# Altium project COMECA - MCU Board.PrjPcb
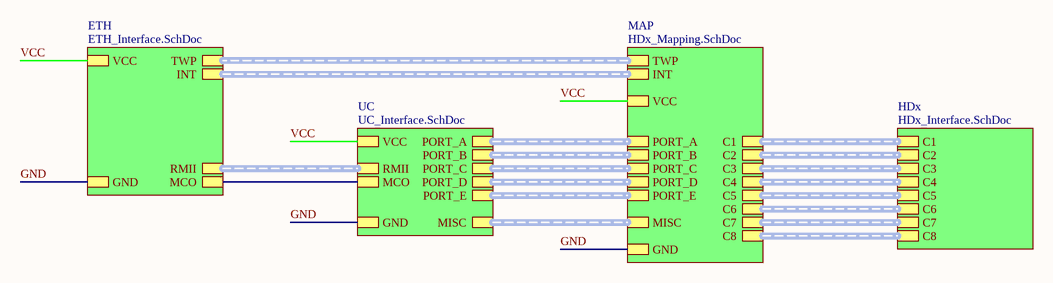
[diagram p0: MCU_Board_top.SchDoc]
5 sheets, 38 parts. Net scope: strictly hierarchical (ports join the sheet entries above them; power ports are local).
Board file: MCU_Board.PcbDoc
Sheets:
  MCU_Board_top.SchDoc
    HDx = HDx_Interface.SchDoc
    ETH = ETH_Interface.SchDoc
    UC = UC_Interface.SchDoc
    MAP = HDx_Mapping.SchDoc

## Sheet MCU_Board_top.SchDoc
size A4; SheetNumber: 1; SheetTotal: 5

### Sub-sheets
ETH = ETH_Interface.SchDoc: GND, VCC, INT (harness INTERFACE), RMII (harness RMII), MCO, TWP (harness TWP_INTERFACE)
HDx = HDx_Interface.SchDoc: C1 (harness C1), C2 (harness C2), C3 (harness C3), C4 (harness C4), C6 (harness C6), C5 (harness C5), C8 (harness C8), C7 (harness C7)
MAP = HDx_Mapping.SchDoc: C1 (harness C1), PORT_A (harness PORT_A), C2 (harness C2), C3 (harness C3), C4 (harness C4), C5 (harness C5), C6 (harness C6), C7 (harness C7), C8 (harness C8), PORT_B (harness PORT_B), PORT_C (harness PORT_C), PORT_D (harness PORT_D), PORT_E (harness PORT_E), MISC (harness MISC), GND, VCC, TWP (harness TWP_INTERFACE), INT (harness INTERFACE)
UC = UC_Interface.SchDoc: GND, VCC, RMII (harness RMII), MCO, PORT_A (harness PORT_A), PORT_B (harness PORT_B), PORT_C (harness PORT_C), PORT_D (harness PORT_D), PORT_E (harness PORT_E), MISC (harness MISC)

### Nets
GND: sheet ETH/GND, sheet UC/GND, sheet MAP/GND
MCO: sheet ETH/MCO, sheet UC/MCO
VCC: sheet ETH/VCC, sheet UC/VCC, sheet MAP/VCC

### Buses and harness runs
harness sheet ETH/INT = sheet MAP/INT
harness sheet ETH/RMII = sheet UC/RMII
harness sheet ETH/TWP = sheet MAP/TWP
harness sheet HDx/C1 = sheet MAP/C1
harness sheet HDx/C2 = sheet MAP/C2
harness sheet HDx/C3 = sheet MAP/C3
harness sheet HDx/C4 = sheet MAP/C4
harness sheet HDx/C5 = sheet MAP/C5
harness sheet HDx/C6 = sheet MAP/C6
harness sheet HDx/C7 = sheet MAP/C7
harness sheet HDx/C8 = sheet MAP/C8
harness sheet MAP/MISC = sheet UC/MISC
harness sheet MAP/PORT_A = sheet UC/PORT_A
harness sheet MAP/PORT_B = sheet UC/PORT_B
harness sheet MAP/PORT_C = sheet UC/PORT_C
harness sheet MAP/PORT_D = sheet UC/PORT_D
harness sheet MAP/PORT_E = sheet UC/PORT_E

## Sheet HDx_Interface.SchDoc
size A4; SheetNumber: 4; SheetTotal: 5
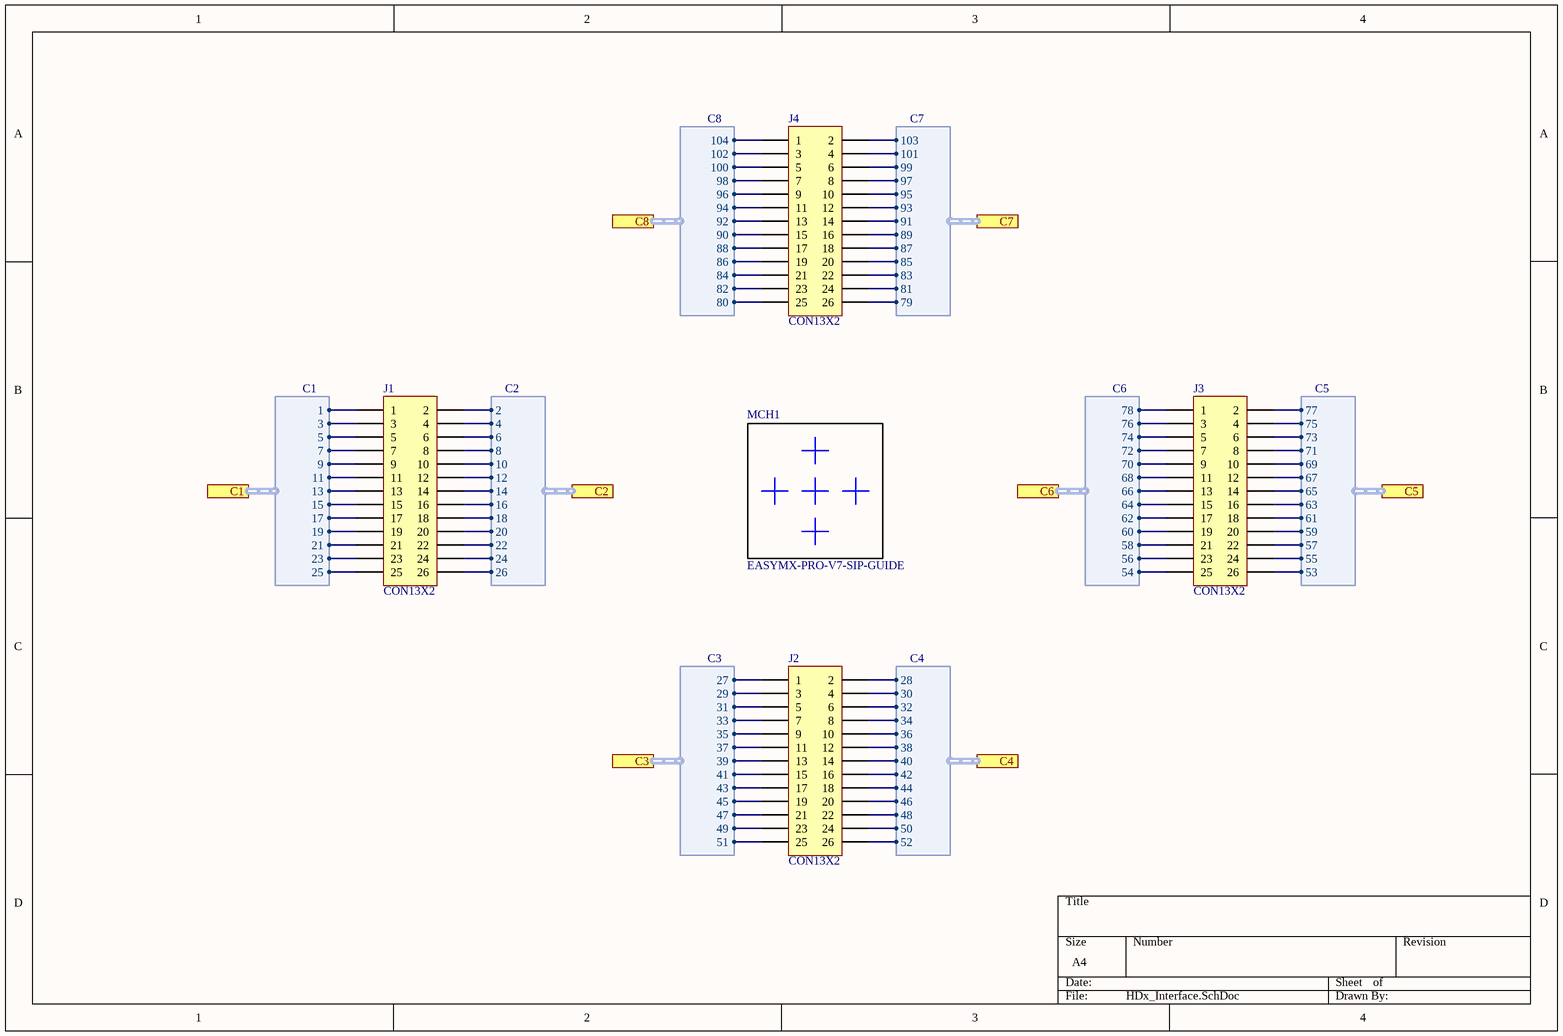
[diagram p1: HDx_Interface.SchDoc]

### Parts
J1  CON13X2  [SIP13X2]
J2  CON13X2  [SIP13X2]
J3  CON13X2  [SIP13X2]
J4  CON13X2  [SIP13X2]
MCH1  EASYMX-PRO-V7-SIP-GUIDE  [EASYMX-PRO-V7-MCH-GUIDE]  (no BOM)

### Ports
C1 (harness C1, see MCU_Board_top[3B], HDx_Mapping[6A]), C2 (harness C2, see MCU_Board_top[3B], HDx_Mapping[7A]), C3 (harness C3, see MCU_Board_top[3B], HDx_Mapping[6B]), C4 (harness C4, see MCU_Board_top[3B], HDx_Mapping[7B]), C5 (harness C5, see MCU_Board_top[3B], HDx_Mapping[6C]), C6 (harness C6, see MCU_Board_top[3B], HDx_Mapping[7C]), C7 (harness C7, see MCU_Board_top[3C], HDx_Mapping[6C]), C8 (harness C8, see MCU_Board_top[3C], HDx_Mapping[7C])

### Harnesses
C1: 1, 3, 5, 7, 9, 11, 13, 15, 17, 19, 21, 23, 25
C2: 2, 4, 6, 8, 10, 12, 14, 16, 18, 20, 22, 24, 26
C3: 27, 29, 31, 33, 35, 37, 39, 41, 43, 45, 47, 49, 51
C4: 28, 30, 32, 34, 36, 38, 40, 42, 44, 46, 48, 50, 52
C6: 54, 56, 58, 60, 62, 64, 66, 68, 70, 72, 74, 76, 78
C5: 53, 55, 57, 59, 61, 63, 65, 67, 69, 71, 73, 75, 77
C8: 80, 82, 84, 86, 88, 90, 92, 94, 96, 98, 100, 102, 104
C7: 79, 81, 83, 85, 87, 89, 91, 93, 95, 97, 99, 101, 103

### Nets
BT0: J3.22 ; port C5.57
GND: J1.26 J2.2 J2.26 J3.1 J3.25 J4.1 J4.25 ; port C2.26, port C4.28, port C4.52, port C6.54, port C6.78, port C8.80, port C8.104
LED1: J1.5 ; port C1.5
LED2: J1.6 ; port C2.6
nRST: J3.10 ; port C5.69
PA0: J3.4 ; port C5.75
PA3: J4.24 ; port C7.81
PA4: J4.21 ; port C8.84
PA5: J4.22 ; port C7.83
PA6: J4.19 ; port C8.86
PA9: J2.4 ; port C4.30
PA10: J2.3 ; port C3.29
PA11: J2.8 ; port C4.34
PA12: J2.7 ; port C3.33
PA13: J2.10 ; port C4.36
PA14: J2.9 ; port C3.35
PA15: J2.12 ; port C4.38
PB0: J4.15 ; port C8.90
PB1: J4.16 ; port C7.89
PB2: J4.13 ; port C8.92
PB3: J2.23 ; port C3.49
PB4: J2.24 ; port C4.50
PB5: J3.23 ; port C6.56
PB6: J3.24 ; port C5.55
PB7: J3.21 ; port C6.58
PB8: J3.20 ; port C5.59
PB9: J3.19 ; port C6.60
PC0: J3.9 ; port C6.70
PC2: J3.7 ; port C6.72
PC3: J3.6 ; port C5.73
PC6: J1.20 ; port C2.20
PC7: J1.19 ; port C1.19
PC8: J1.22 ; port C2.22
PC9: J1.21 ; port C1.21
PC13: J3.11 ; port C6.68
PD0: J2.16 ; port C4.42
PD1: J2.15 ; port C3.41
PD2: J2.18 ; port C4.44
PD3: J2.17 ; port C3.43
PD4: J2.20 ; port C4.46
PD5: J2.19 ; port C3.45
PD6: J2.22 ; port C4.48
PD7: J2.21 ; port C3.47
PD8: J1.12 ; port C2.12
PD9: J1.11 ; port C1.11
PD10: J1.14 ; port C2.14
PD11: J1.13 ; port C1.13
PD12: J1.16 ; port C2.16
PD13: J1.15 ; port C1.15
PD14: J1.18 ; port C2.18
PD15: J1.17 ; port C1.17
PE0: J3.18 ; port C5.61
PE1: J3.17 ; port C6.62
PE2: J3.16 ; port C5.63
PE3: J3.15 ; port C6.64
PE4: J3.14 ; port C5.65
PE5: J3.13 ; port C6.66
PE6: J3.12 ; port C5.67
PE7: J4.14 ; port C7.91
PE8: J4.11 ; port C8.94
PE9: J4.12 ; port C7.93
PE10: J4.9 ; port C8.96
PE11: J4.10 ; port C7.95
PE12: J4.7 ; port C8.98
PE13: J4.8 ; port C7.97
PE14: J4.5 ; port C8.100
PE15: J4.6 ; port C7.99
RX_N: J1.3 ; port C1.3
RX_P: J1.4 ; port C2.4
SPI_MISO: J1.10 ; port C2.10
SPI_MOSI: J1.9 ; port C1.9
SPI_SCK: J1.7 ; port C1.7
TX_N: J1.1 ; port C1.1
TX_P: J1.2 ; port C2.2
VBAT: J1.23 ; port C1.23
VCC: J1.25 J2.1 J2.25 J3.2 J3.26 J4.2 J4.26 ; port C1.25, port C3.27, port C3.51, port C5.53, port C5.77, port C7.79, port C7.103
VREF: J3.5 ; port C6.74
NetJ1_8: J1.8 ; port C2.8
NetJ1_24: J1.24 ; port C2.24
NetJ2_5: J2.5 ; port C3.31
NetJ2_6: J2.6 ; port C4.32
NetJ2_11: J2.11 ; port C3.37
NetJ2_13: J2.13 ; port C3.39
NetJ2_14: J2.14 ; port C4.40
NetJ3_3: J3.3 ; port C6.76
NetJ3_8: J3.8 ; port C5.71
NetJ4_3: J4.3 ; port C8.102
NetJ4_4: J4.4 ; port C7.101
NetJ4_17: J4.17 ; port C8.88
NetJ4_18: J4.18 ; port C7.87
NetJ4_20: J4.20 ; port C7.85
NetJ4_23: J4.23 ; port C8.82

### Library data of the parts
MCH1 = EASYMX-PRO-V7-SIP-GUIDE: EasyMx Pro V7 mechanical centers for SIP connectors

## Sheet ETH_Interface.SchDoc
size A4; SheetNumber: 2; SheetTotal: 5
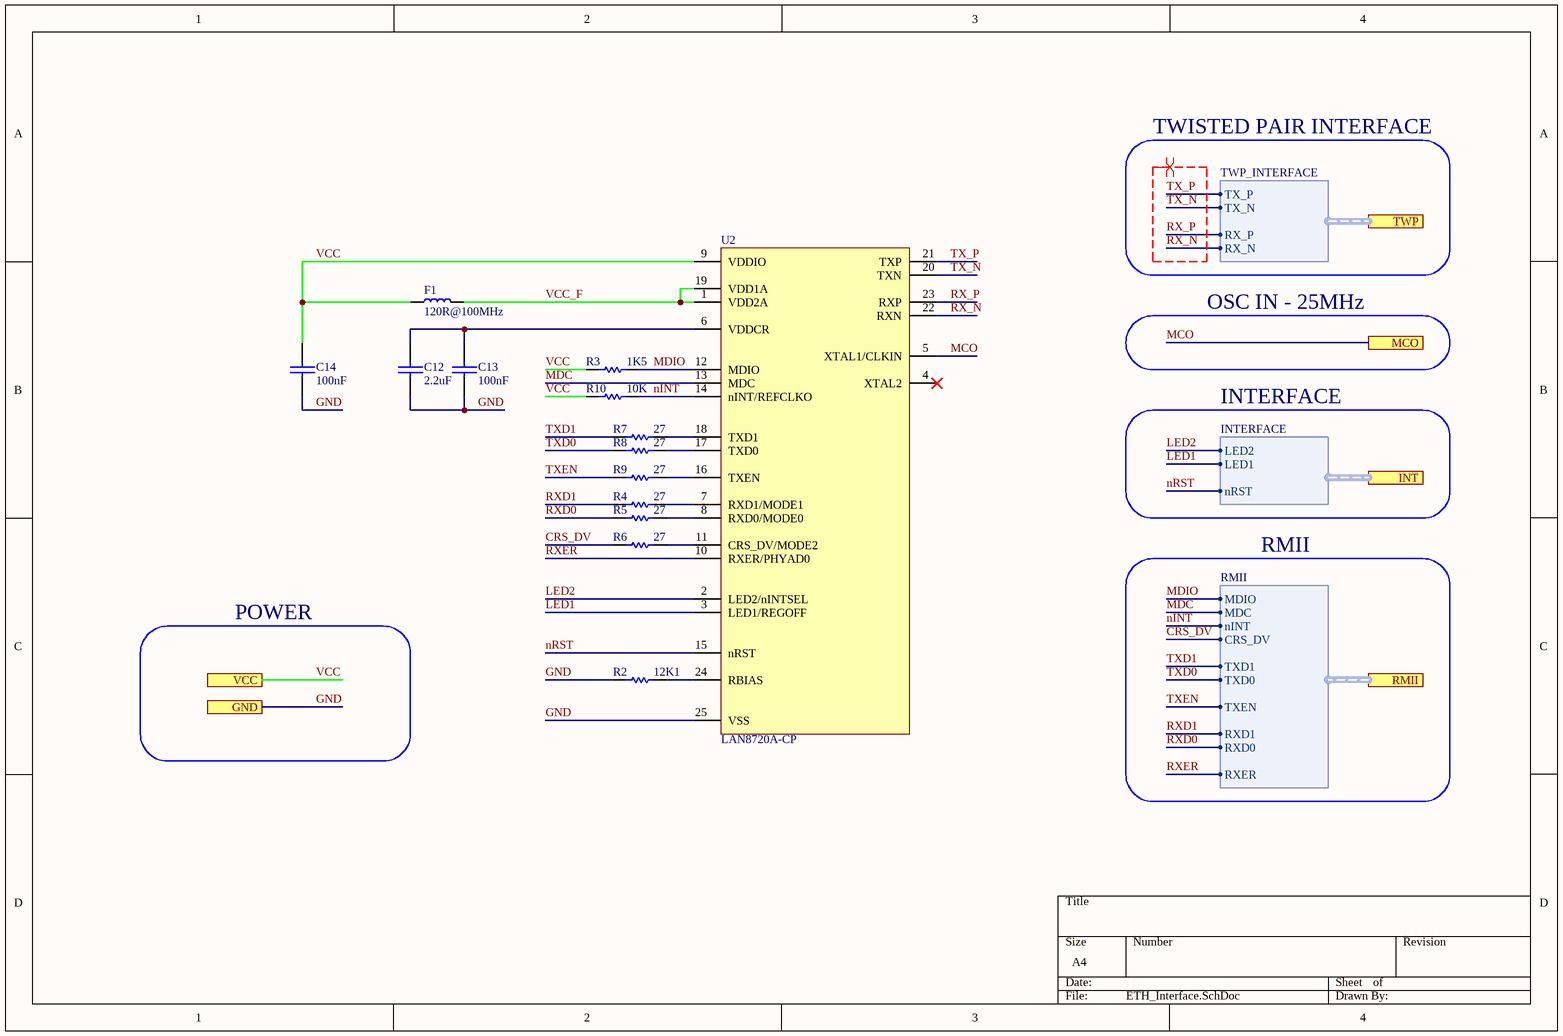
[diagram p2: ETH_Interface.SchDoc]

### Parts
C12  2.2uF  [0603-CAP-TDK]
C13  100nF  [0402-CAP-TDK]
C14  100nF  [0402-CAP-TDK]
F1  120R@100MHz  [0603-IND-MURATA]
R2  12K1  [0402-RES-PANASONIC]
R3  1K5  [0402-RES-PANASONIC]
R4  27  [0402-RES-PANASONIC]
R5  27  [0402-RES-PANASONIC]
R6  27  [0402-RES-PANASONIC]
R7  27  [0402-RES-PANASONIC]
R8  27  [0402-RES-PANASONIC]
R9  27  [0402-RES-PANASONIC]
R10  10K  [0402-RES-PANASONIC]
U2  LAN8720A-CP  [MC 24-QFN-PUNCH]

### Ports
GND (see MCU_Board_top[1B], HDx_Mapping[2D], UC_Interface[1C]), INT (harness INTERFACE, see MCU_Board_top[2B], HDx_Mapping[3C]), MCO (see MCU_Board_top[2B], UC_Interface[1C]), RMII (harness RMII, see MCU_Board_top[2B], UC_Interface[1D]), TWP (harness TWP_INTERFACE, see MCU_Board_top[2B], HDx_Mapping[4D]), VCC (see MCU_Board_top[1B], HDx_Mapping[2D], UC_Interface[1C])

### Harnesses
RMII: MDIO, MDC, nINT, TXD1, TXD0, TXEN, RXD1, RXD0, RXER, CRS_DV
INTERFACE: LED2, LED1, nRST
TWP_INTERFACE: TX_P, TX_N, RX_P, RX_N

### Nets
CRS_DV: R6.1 ; port RMII.CRS_DV
GND: C12.1 C13.1 C14.1 R2.1 U2.25(VSS) ; port GND
LED1: U2.3(LED1/REGOFF) ; port INT.LED1
LED2: U2.2(LED2/nINTSEL) ; port INT.LED2
MCO: U2.5(XTAL1/CLKIN) ; port MCO
MDC: U2.13(MDC) ; port RMII.MDC
MDIO: R3.2 U2.12(MDIO) ; port RMII.MDIO
nINT: R10.2 U2.14(nINT/REFCLKO) ; port RMII.nINT
nRST: U2.15(nRST) ; port INT.nRST
RX_N: U2.22(RXN) ; port TWP.RX_N
RX_P: U2.23(RXP) ; port TWP.RX_P
RXD0: R5.1 ; port RMII.RXD0
RXD1: R4.1 ; port RMII.RXD1
RXER: U2.10(RXER/PHYAD0) ; port RMII.RXER
TX_N: U2.20(TXN) ; port TWP.TX_N
TX_P: U2.21(TXP) ; port TWP.TX_P
TXD0: R8.1 ; port RMII.TXD0
TXD1: R7.1 ; port RMII.TXD1
TXEN: R9.1 ; port RMII.TXEN
VCC: C14.2 F1.2 R3.1 R10.1 U2.9(VDDIO) ; port VCC
VCC_F: F1.1 U2.1(VDD2A) U2.19(VDD1A)
NetC12_2: C12.2 C13.2 U2.6(VDDCR)
NetR2_2: R2.2 U2.24(RBIAS)
NetR4_2: R4.2 U2.7(RXD1/MODE1)
NetR5_2: R5.2 U2.8(RXD0/MODE0)
NetR6_2: R6.2 U2.11(CRS_DV/MODE2)
NetR7_2: R7.2 U2.18(TXD1)
NetR8_2: R8.2 U2.17(TXD0)
NetR9_2: R9.2 U2.16(TXEN)

Not connected (* = marked no-connect by the designer): U2 4(XTAL2)*

### Layout directives
differential pair; differential pair class ETH: RX_N, RX_P, TX_N, TX_P

### Notes on the sheet
- TWISTED PAIR INTERFACE
- OSC IN - 25MHz
- INTERFACE
- RMII
- POWER

### Library data of the parts
C12-C14 = CAP-SMD
F1 = BLM18BD121SN1D
R2-R10 = RES-SMD

## Sheet UC_Interface.SchDoc
size A3; SheetNumber: 3; SheetTotal: 5
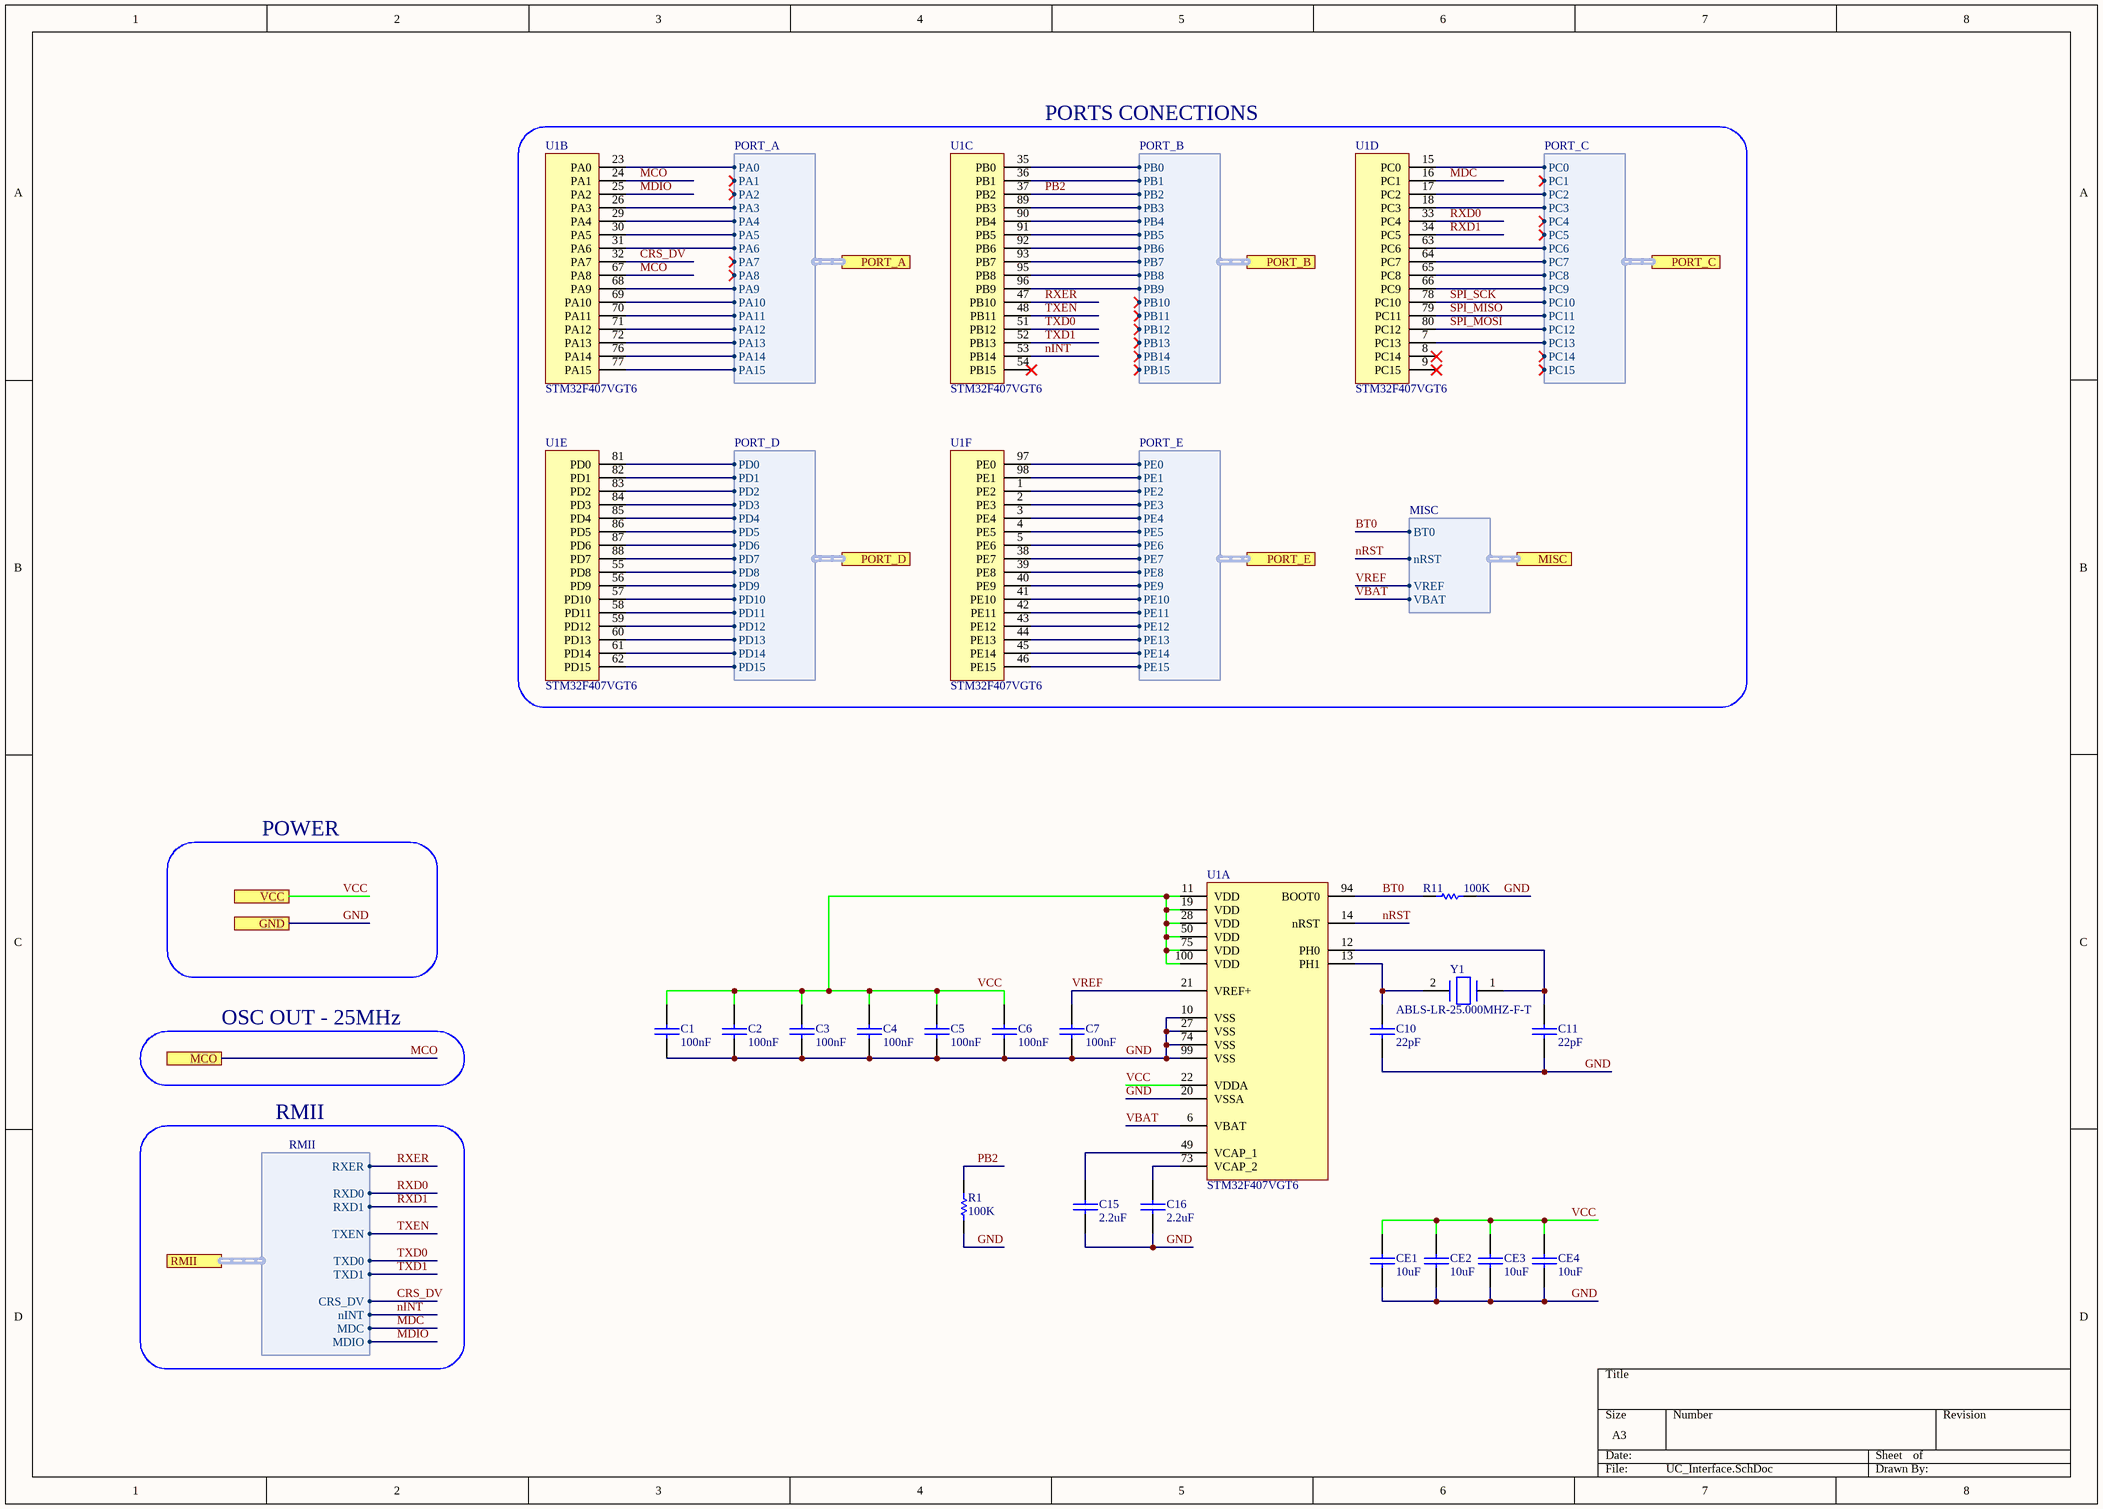
[diagram p3: UC_Interface.SchDoc]

### Parts
C1  100nF  [0402-CAP-TDK]
C2  100nF  [0402-CAP-TDK]
C3  100nF  [0402-CAP-TDK]
C4  100nF  [0402-CAP-TDK]
C5  100nF  [0402-CAP-TDK]
C6  100nF  [0402-CAP-TDK]
C7  100nF  [0402-CAP-TDK]
C10  22pF  [0603-CAP-TDK]
C11  22pF  [0603-CAP-TDK]
C15  2.2uF  [0603-CAP-TDK]
C16  2.2uF  [0603-CAP-TDK]
CE1  10uF  [0805-CAP-TDK]
CE2  10uF  [0805-CAP-TDK]
CE3  10uF  [0805-CAP-TDK]
CE4  10uF  [0805-CAP-TDK]
R1  100K  [0402-RES-PANASONIC]
R11  100K  [0402-RES-PANASONIC]
U1  STM32F407VGT6  [LQFP-100]  (parts A,B,C,D,E,F of 6)
Y1  ABLS-LR-25.000MHZ-F-T  [HC49S]

### Blocks framed on the sheet
PORTS CONECTIONS: U1

### Ports
GND (see MCU_Board_top[2C], ETH_Interface[1C], HDx_Mapping[2D]), MCO (see MCU_Board_top[2B], ETH_Interface[4B]), MISC (harness MISC, see MCU_Board_top[2C], HDx_Mapping[2C]), PORT_A (harness PORT_A, see MCU_Board_top[2B], HDx_Mapping[2A]), PORT_B (harness PORT_B, see MCU_Board_top[2B], HDx_Mapping[4A]), PORT_C (harness PORT_C, see MCU_Board_top[2B], HDx_Mapping[2B]), PORT_D (harness PORT_D, see MCU_Board_top[2B], HDx_Mapping[4B]), PORT_E (harness PORT_E, see MCU_Board_top[2B], HDx_Mapping[4C]), RMII (harness RMII, see MCU_Board_top[2B], ETH_Interface[4C]), VCC (see MCU_Board_top[2B], ETH_Interface[1C], HDx_Mapping[2D])

### Harnesses
PORT_A: PA6, PA7, PA8, PA5, PA9, PA4, PA10, PA3, PA11, PA2, PA1, PA0, PA12, PA13, PA14, PA15
PORT_B: PB6, PB7, PB8, PB5, PB9, PB4, PB10, PB3, PB11, PB2, PB1, PB0, PB12, PB13, PB14, PB15
RMII: MDIO, MDC, nINT, TXD1, TXD0, TXEN, RXD1, RXD0, RXER, CRS_DV
PORT_C: PC6, PC7, PC8, PC5, PC9, PC4, PC10, PC3, PC11, PC2, PC1, PC0, PC12, PC13, PC14, PC15
PORT_D: PD6, PD7, PD8, PD5, PD9, PD4, PD10, PD3, PD11, PD2, PD1, PD0, PD12, PD13, PD14, PD15
PORT_E: PE6, PE7, PE8, PE5, PE9, PE4, PE10, PE3, PE11, PE2, PE1, PE0, PE12, PE13, PE14, PE15
MISC: BT0, nRST, VREF, VBAT

### Nets
BT0: R11.1 U1.94(BOOT0) ; port MISC.BT0
CRS_DV: U1.32(PA7) ; port RMII.CRS_DV
GND: C1.1 C2.1 C3.1 C4.1 C5.1 C6.1 C7.2 C10.1 C11.1 C15.1 C16.1 CE1.1 CE2.1 CE3.1 CE4.1 R1.1 R11.2 U1.10(VSS) U1.20(VSSA) U1.27(VSS) U1.74(VSS) U1.99(VSS) ; port GND
MCO: U1.24(PA1) U1.67(PA8) ; port MCO
MDC: U1.16(PC1) ; port RMII.MDC
MDIO: U1.25(PA2) ; port RMII.MDIO
nINT: U1.53(PB14) ; port RMII.nINT
nRST: U1.14(nRST) ; port MISC.nRST
PA0: U1.23(PA0) ; port PORT_A.PA0
PA3: U1.26(PA3) ; port PORT_A.PA3
PA4: U1.29(PA4) ; port PORT_A.PA4
PA5: U1.30(PA5) ; port PORT_A.PA5
PA6: U1.31(PA6) ; port PORT_A.PA6
PA9: U1.68(PA9) ; port PORT_A.PA9
PA10: U1.69(PA10) ; port PORT_A.PA10
PA11: U1.70(PA11) ; port PORT_A.PA11
PA12: U1.71(PA12) ; port PORT_A.PA12
PA13: U1.72(PA13) ; port PORT_A.PA13
PA14: U1.76(PA14) ; port PORT_A.PA14
PA15: U1.77(PA15) ; port PORT_A.PA15
PB0: U1.35(PB0) ; port PORT_B.PB0
PB1: U1.36(PB1) ; port PORT_B.PB1
PB2: R1.2 U1.37(PB2) ; port PORT_B.PB2
PB3: U1.89(PB3) ; port PORT_B.PB3
PB4: U1.90(PB4) ; port PORT_B.PB4
PB5: U1.91(PB5) ; port PORT_B.PB5
PB6: U1.92(PB6) ; port PORT_B.PB6
PB7: U1.93(PB7) ; port PORT_B.PB7
PB8: U1.95(PB8) ; port PORT_B.PB8
PB9: U1.96(PB9) ; port PORT_B.PB9
PC0: U1.15(PC0) ; port PORT_C.PC0
PC2: U1.17(PC2) ; port PORT_C.PC2
PC3: U1.18(PC3) ; port PORT_C.PC3
PC6: U1.63(PC6) ; port PORT_C.PC6
PC7: U1.64(PC7) ; port PORT_C.PC7
PC8: U1.65(PC8) ; port PORT_C.PC8
PC9: U1.66(PC9) ; port PORT_C.PC9
PC13: U1.7(PC13) ; port PORT_C.PC13
PD0: U1.81(PD0) ; port PORT_D.PD0
PD1: U1.82(PD1) ; port PORT_D.PD1
PD2: U1.83(PD2) ; port PORT_D.PD2
PD3: U1.84(PD3) ; port PORT_D.PD3
PD4: U1.85(PD4) ; port PORT_D.PD4
PD5: U1.86(PD5) ; port PORT_D.PD5
PD6: U1.87(PD6) ; port PORT_D.PD6
PD7: U1.88(PD7) ; port PORT_D.PD7
PD8: U1.55(PD8) ; port PORT_D.PD8
PD9: U1.56(PD9) ; port PORT_D.PD9
PD10: U1.57(PD10) ; port PORT_D.PD10
PD11: U1.58(PD11) ; port PORT_D.PD11
PD12: U1.59(PD12) ; port PORT_D.PD12
PD13: U1.60(PD13) ; port PORT_D.PD13
PD14: U1.61(PD14) ; port PORT_D.PD14
PD15: U1.62(PD15) ; port PORT_D.PD15
PE0: U1.97(PE0) ; port PORT_E.PE0
PE1: U1.98(PE1) ; port PORT_E.PE1
PE2: U1.1(PE2) ; port PORT_E.PE2
PE3: U1.2(PE3) ; port PORT_E.PE3
PE4: U1.3(PE4) ; port PORT_E.PE4
PE5: U1.4(PE5) ; port PORT_E.PE5
PE6: U1.5(PE6) ; port PORT_E.PE6
PE7: U1.38(PE7) ; port PORT_E.PE7
PE8: U1.39(PE8) ; port PORT_E.PE8
PE9: U1.40(PE9) ; port PORT_E.PE9
PE10: U1.41(PE10) ; port PORT_E.PE10
PE11: U1.42(PE11) ; port PORT_E.PE11
PE12: U1.43(PE12) ; port PORT_E.PE12
PE13: U1.44(PE13) ; port PORT_E.PE13
PE14: U1.45(PE14) ; port PORT_E.PE14
PE15: U1.46(PE15) ; port PORT_E.PE15
RXD0: U1.33(PC4) ; port RMII.RXD0
RXD1: U1.34(PC5) ; port RMII.RXD1
RXER: U1.47(PB10) ; port RMII.RXER
SPI_MISO: U1.79(PC11) ; port PORT_C.PC11
SPI_MOSI: U1.80(PC12) ; port PORT_C.PC12
SPI_SCK: U1.78(PC10) ; port PORT_C.PC10
TXD0: U1.51(PB12) ; port RMII.TXD0
TXD1: U1.52(PB13) ; port RMII.TXD1
TXEN: U1.48(PB11) ; port RMII.TXEN
VBAT: U1.6(VBAT) ; port MISC.VBAT
VCC: C1.2 C2.2 C3.2 C4.2 C5.2 C6.2 CE1.2 CE2.2 CE3.2 CE4.2 U1.11(VDD) U1.19(VDD) U1.22(VDDA) U1.28(VDD) U1.50(VDD) U1.75(VDD) U1.100(VDD) ; port VCC
VREF: C7.1 U1.21(VREF+) ; port MISC.VREF
NetC10_2: C10.2 U1.13(PH1) Y1.2
NetC11_2: C11.2 U1.12(PH0) Y1.1
NetC15_2: C15.2 U1.49(VCAP_1)
NetC16_2: C16.2 U1.73(VCAP_2)

Not connected (* = marked no-connect by the designer): U1 8(PC14)* 9(PC15)* 54(PB15)*

### Notes on the sheet
- POWER
- OSC OUT - 25MHz
- RMII

### Library data of the parts
C1-C7 C10 C11 C15 C16 CE1-CE4 = CAP-SMD
R1 R11 = RES-SMD
Y1 = 25.000MHz Crystal

## Sheet HDx_Mapping.SchDoc
size A3; SheetNumber: 5; SheetTotal: 5
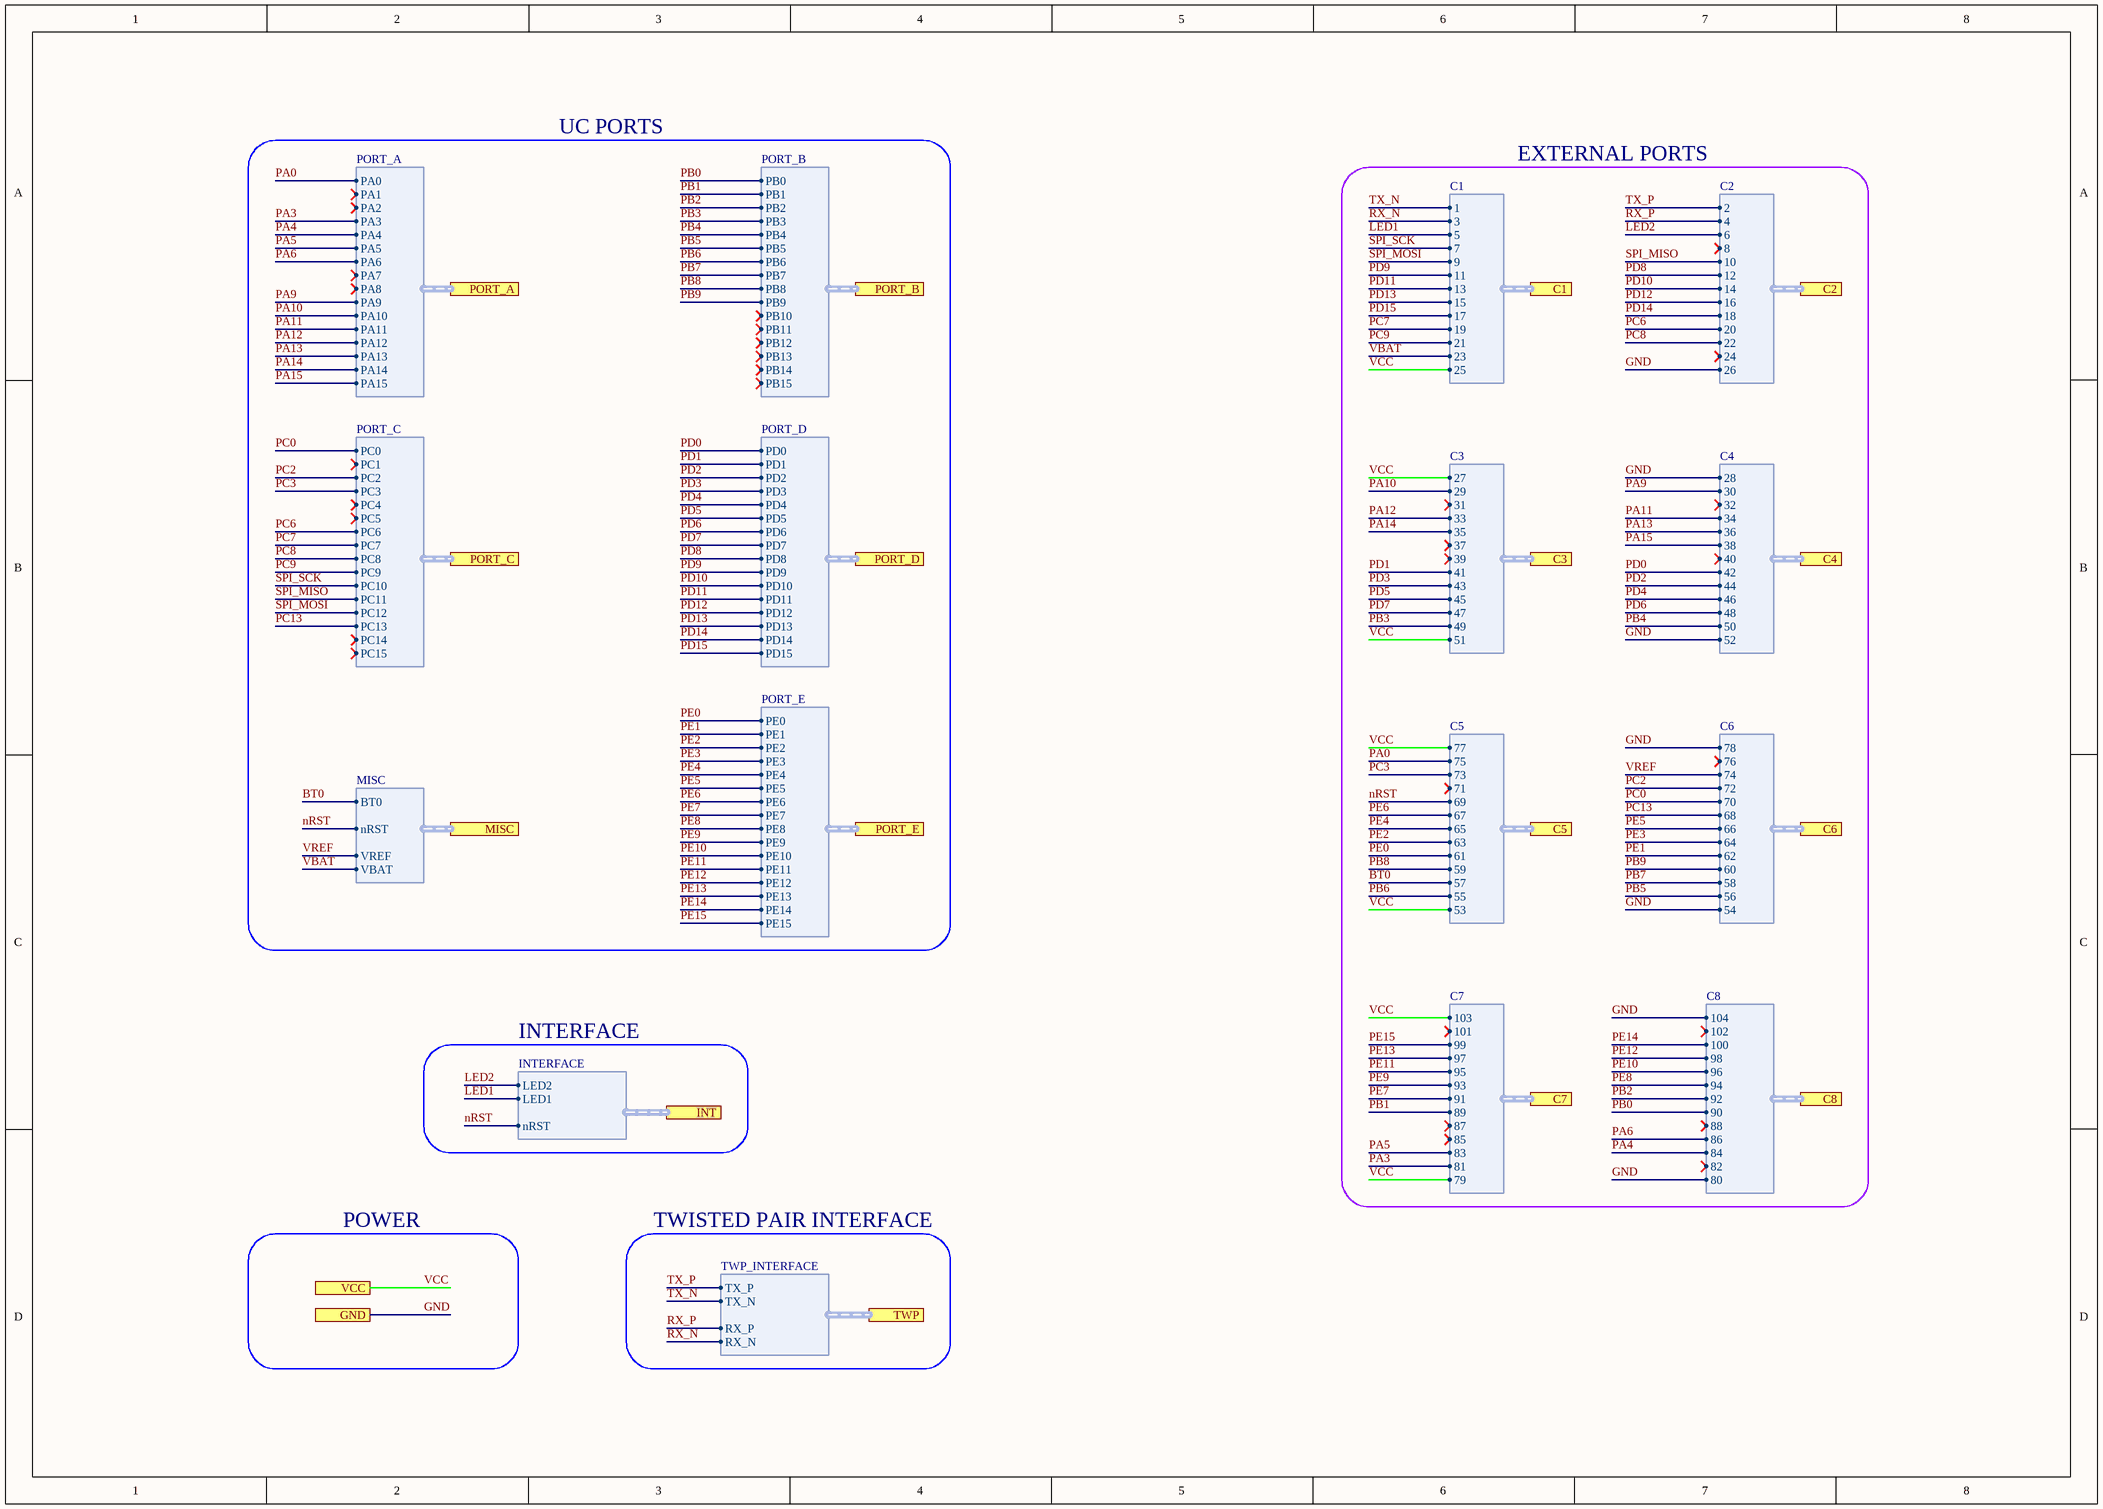
[diagram p4: HDx_Mapping.SchDoc]

### Ports
C1 (harness C1, see MCU_Board_top[3B], HDx_Interface[1B]), C2 (harness C2, see MCU_Board_top[3B], HDx_Interface[2B]), C3 (harness C3, see MCU_Board_top[3B], HDx_Interface[2C]), C4 (harness C4, see MCU_Board_top[3B], HDx_Interface[3C]), C5 (harness C5, see MCU_Board_top[3B], HDx_Interface[4B]), C6 (harness C6, see MCU_Board_top[3B], HDx_Interface[3B]), C7 (harness C7, see MCU_Board_top[3C], HDx_Interface[3A]), C8 (harness C8, see MCU_Board_top[3C], HDx_Interface[2A]), GND (see MCU_Board_top[3C], ETH_Interface[1C], UC_Interface[1C]), INT (harness INTERFACE, see MCU_Board_top[3B], ETH_Interface[4B]), MISC (harness MISC, see MCU_Board_top[3C], UC_Interface[6B]), PORT_A (harness PORT_A, see MCU_Board_top[3B], UC_Interface[4A]), PORT_B (harness PORT_B, see MCU_Board_top[3B], UC_Interface[5A]), PORT_C (harness PORT_C, see MCU_Board_top[3B], UC_Interface[7A]), PORT_D (harness PORT_D, see MCU_Board_top[3B], UC_Interface[4B]), PORT_E (harness PORT_E, see MCU_Board_top[3B], UC_Interface[5B]), TWP (harness TWP_INTERFACE, see MCU_Board_top[3B], ETH_Interface[4A]), VCC (see MCU_Board_top[3B], ETH_Interface[1C], UC_Interface[1C])

### Harnesses
C1: 1, 3, 5, 7, 9, 11, 13, 15, 17, 19, 21, 23, 25
PORT_A: PA0, PA1, PA2, PA3, PA4, PA5, PA6, PA7, PA8, PA9, PA10, PA11, PA12, PA13, PA14, PA15
C2: 2, 4, 6, 8, 10, 12, 14, 16, 18, 20, 22, 24, 26
C3: 27, 29, 31, 33, 35, 37, 39, 41, 43, 45, 47, 49, 51
C4: 28, 30, 32, 34, 36, 38, 40, 42, 44, 46, 48, 50, 52
C5: 77, 75, 73, 71, 69, 67, 65, 63, 61, 59, 57, 55, 53
C6: 78, 76, 74, 72, 70, 68, 66, 64, 62, 60, 58, 56, 54
C7: 103, 101, 99, 97, 95, 93, 91, 89, 87, 85, 83, 81, 79
C8: 104, 102, 100, 98, 96, 94, 92, 90, 88, 86, 84, 82, 80
PORT_B: PB0, PB1, PB2, PB3, PB4, PB5, PB6, PB7, PB8, PB9, PB10, PB11, PB12, PB13, PB14, PB15
PORT_C: PC0, PC1, PC2, PC3, PC4, PC5, PC6, PC7, PC8, PC9, PC10, PC11, PC12, PC13, PC14, PC15
PORT_D: PD0, PD1, PD2, PD3, PD4, PD5, PD6, PD7, PD8, PD9, PD10, PD11, PD12, PD13, PD14, PD15
PORT_E: PE0, PE1, PE2, PE3, PE4, PE5, PE6, PE7, PE8, PE9, PE10, PE11, PE12, PE13, PE14, PE15
MISC: BT0, nRST, VREF, VBAT
TWP_INTERFACE: TX_P, TX_N, RX_P, RX_N
INTERFACE: LED2, LED1, nRST

### Nets
BT0: port C5.57, port MISC.BT0
GND: port GND, port C2.26, port C4.28, port C4.52, port C6.78, port C6.54, port C8.104, port C8.80
LED1: port C1.5, port INT.LED1
LED2: port C2.6, port INT.LED2
nRST: port C5.69, port MISC.nRST, port INT.nRST
PA0: port PORT_A.PA0, port C5.75
PA3: port PORT_A.PA3, port C7.81
PA4: port PORT_A.PA4, port C8.84
PA5: port PORT_A.PA5, port C7.83
PA6: port PORT_A.PA6, port C8.86
PA9: port PORT_A.PA9, port C4.30
PA10: port PORT_A.PA10, port C3.29
PA11: port PORT_A.PA11, port C4.34
PA12: port PORT_A.PA12, port C3.33
PA13: port PORT_A.PA13, port C4.36
PA14: port PORT_A.PA14, port C3.35
PA15: port PORT_A.PA15, port C4.38
PB0: port C8.90, port PORT_B.PB0
PB1: port C7.89, port PORT_B.PB1
PB2: port C8.92, port PORT_B.PB2
PB3: port C3.49, port PORT_B.PB3
PB4: port C4.50, port PORT_B.PB4
PB5: port C6.56, port PORT_B.PB5
PB6: port C5.55, port PORT_B.PB6
PB7: port C6.58, port PORT_B.PB7
PB8: port C5.59, port PORT_B.PB8
PB9: port C6.60, port PORT_B.PB9
PC0: port C6.70, port PORT_C.PC0
PC2: port C6.72, port PORT_C.PC2
PC3: port C5.73, port PORT_C.PC3
PC6: port C2.20, port PORT_C.PC6
PC7: port C1.19, port PORT_C.PC7
PC8: port C2.22, port PORT_C.PC8
PC9: port C1.21, port PORT_C.PC9
PC13: port C6.68, port PORT_C.PC13
PD0: port C4.42, port PORT_D.PD0
PD1: port C3.41, port PORT_D.PD1
PD2: port C4.44, port PORT_D.PD2
PD3: port C3.43, port PORT_D.PD3
PD4: port C4.46, port PORT_D.PD4
PD5: port C3.45, port PORT_D.PD5
PD6: port C4.48, port PORT_D.PD6
PD7: port C3.47, port PORT_D.PD7
PD8: port C2.12, port PORT_D.PD8
PD9: port C1.11, port PORT_D.PD9
PD10: port C2.14, port PORT_D.PD10
PD11: port C1.13, port PORT_D.PD11
PD12: port C2.16, port PORT_D.PD12
PD13: port C1.15, port PORT_D.PD13
PD14: port C2.18, port PORT_D.PD14
PD15: port C1.17, port PORT_D.PD15
PE0: port C5.61, port PORT_E.PE0
PE1: port C6.62, port PORT_E.PE1
PE2: port C5.63, port PORT_E.PE2
PE3: port C6.64, port PORT_E.PE3
PE4: port C5.65, port PORT_E.PE4
PE5: port C6.66, port PORT_E.PE5
PE6: port C5.67, port PORT_E.PE6
PE7: port C7.91, port PORT_E.PE7
PE8: port C8.94, port PORT_E.PE8
PE9: port C7.93, port PORT_E.PE9
PE10: port C8.96, port PORT_E.PE10
PE11: port C7.95, port PORT_E.PE11
PE12: port C8.98, port PORT_E.PE12
PE13: port C7.97, port PORT_E.PE13
PE14: port C8.100, port PORT_E.PE14
PE15: port C7.99, port PORT_E.PE15
RX_N: port C1.3, port TWP.RX_N
RX_P: port C2.4, port TWP.RX_P
SPI_MISO: port C2.10, port PORT_C.PC11
SPI_MOSI: port C1.9, port PORT_C.PC12
SPI_SCK: port C1.7, port PORT_C.PC10
TX_N: port C1.1, port TWP.TX_N
TX_P: port C2.2, port TWP.TX_P
VBAT: port C1.23, port MISC.VBAT
VCC: port VCC, port C1.25, port C3.27, port C3.51, port C5.77, port C5.53, port C7.103, port C7.79
VREF: port C6.74, port MISC.VREF

### Notes on the sheet
- UC PORTS
- EXTERNAL PORTS
- INTERFACE
- POWER
- TWISTED PAIR INTERFACE

## Nets that join several sheets
BT0: HDx_Interface (J3.22), UC_Interface (R11.1 U1.94)
CRS_DV: ETH_Interface (R6.1), UC_Interface (U1.32)
GND: HDx_Interface (7 pins), ETH_Interface (5 pins), UC_Interface (22 pins)
LED1: HDx_Interface (J1.5), ETH_Interface (U2.3)
LED2: HDx_Interface (J1.6), ETH_Interface (U2.2)
MCO: ETH_Interface (U2.5), UC_Interface (U1.24 U1.67)
MDC: ETH_Interface (U2.13), UC_Interface (U1.16)
MDIO: ETH_Interface (R3.2 U2.12), UC_Interface (U1.25)
nINT: ETH_Interface (R10.2 U2.14), UC_Interface (U1.53)
nRST: HDx_Interface (J3.10), ETH_Interface (U2.15), UC_Interface (U1.14)
PA0: HDx_Interface (J3.4), UC_Interface (U1.23)
PA3: HDx_Interface (J4.24), UC_Interface (U1.26)
PA4: HDx_Interface (J4.21), UC_Interface (U1.29)
PA5: HDx_Interface (J4.22), UC_Interface (U1.30)
PA6: HDx_Interface (J4.19), UC_Interface (U1.31)
PA9: HDx_Interface (J2.4), UC_Interface (U1.68)
PA10: HDx_Interface (J2.3), UC_Interface (U1.69)
PA11: HDx_Interface (J2.8), UC_Interface (U1.70)
PA12: HDx_Interface (J2.7), UC_Interface (U1.71)
PA13: HDx_Interface (J2.10), UC_Interface (U1.72)
PA14: HDx_Interface (J2.9), UC_Interface (U1.76)
PA15: HDx_Interface (J2.12), UC_Interface (U1.77)
PB0: HDx_Interface (J4.15), UC_Interface (U1.35)
PB1: HDx_Interface (J4.16), UC_Interface (U1.36)
PB2: HDx_Interface (J4.13), UC_Interface (R1.2 U1.37)
PB3: HDx_Interface (J2.23), UC_Interface (U1.89)
PB4: HDx_Interface (J2.24), UC_Interface (U1.90)
PB5: HDx_Interface (J3.23), UC_Interface (U1.91)
PB6: HDx_Interface (J3.24), UC_Interface (U1.92)
PB7: HDx_Interface (J3.21), UC_Interface (U1.93)
PB8: HDx_Interface (J3.20), UC_Interface (U1.95)
PB9: HDx_Interface (J3.19), UC_Interface (U1.96)
PC0: HDx_Interface (J3.9), UC_Interface (U1.15)
PC2: HDx_Interface (J3.7), UC_Interface (U1.17)
PC3: HDx_Interface (J3.6), UC_Interface (U1.18)
PC6: HDx_Interface (J1.20), UC_Interface (U1.63)
PC7: HDx_Interface (J1.19), UC_Interface (U1.64)
PC8: HDx_Interface (J1.22), UC_Interface (U1.65)
PC9: HDx_Interface (J1.21), UC_Interface (U1.66)
PC13: HDx_Interface (J3.11), UC_Interface (U1.7)
PD0: HDx_Interface (J2.16), UC_Interface (U1.81)
PD1: HDx_Interface (J2.15), UC_Interface (U1.82)
PD2: HDx_Interface (J2.18), UC_Interface (U1.83)
PD3: HDx_Interface (J2.17), UC_Interface (U1.84)
PD4: HDx_Interface (J2.20), UC_Interface (U1.85)
PD5: HDx_Interface (J2.19), UC_Interface (U1.86)
PD6: HDx_Interface (J2.22), UC_Interface (U1.87)
PD7: HDx_Interface (J2.21), UC_Interface (U1.88)
PD8: HDx_Interface (J1.12), UC_Interface (U1.55)
PD9: HDx_Interface (J1.11), UC_Interface (U1.56)
PD10: HDx_Interface (J1.14), UC_Interface (U1.57)
PD11: HDx_Interface (J1.13), UC_Interface (U1.58)
PD12: HDx_Interface (J1.16), UC_Interface (U1.59)
PD13: HDx_Interface (J1.15), UC_Interface (U1.60)
PD14: HDx_Interface (J1.18), UC_Interface (U1.61)
PD15: HDx_Interface (J1.17), UC_Interface (U1.62)
PE0: HDx_Interface (J3.18), UC_Interface (U1.97)
PE1: HDx_Interface (J3.17), UC_Interface (U1.98)
PE2: HDx_Interface (J3.16), UC_Interface (U1.1)
PE3: HDx_Interface (J3.15), UC_Interface (U1.2)
PE4: HDx_Interface (J3.14), UC_Interface (U1.3)
PE5: HDx_Interface (J3.13), UC_Interface (U1.4)
PE6: HDx_Interface (J3.12), UC_Interface (U1.5)
PE7: HDx_Interface (J4.14), UC_Interface (U1.38)
PE8: HDx_Interface (J4.11), UC_Interface (U1.39)
PE9: HDx_Interface (J4.12), UC_Interface (U1.40)
PE10: HDx_Interface (J4.9), UC_Interface (U1.41)
PE11: HDx_Interface (J4.10), UC_Interface (U1.42)
PE12: HDx_Interface (J4.7), UC_Interface (U1.43)
PE13: HDx_Interface (J4.8), UC_Interface (U1.44)
PE14: HDx_Interface (J4.5), UC_Interface (U1.45)
PE15: HDx_Interface (J4.6), UC_Interface (U1.46)
RX_N: HDx_Interface (J1.3), ETH_Interface (U2.22)
RX_P: HDx_Interface (J1.4), ETH_Interface (U2.23)
RXD0: ETH_Interface (R5.1), UC_Interface (U1.33)
RXD1: ETH_Interface (R4.1), UC_Interface (U1.34)
RXER: ETH_Interface (U2.10), UC_Interface (U1.47)
SPI_MISO: HDx_Interface (J1.10), UC_Interface (U1.79)
SPI_MOSI: HDx_Interface (J1.9), UC_Interface (U1.80)
SPI_SCK: HDx_Interface (J1.7), UC_Interface (U1.78)
TX_N: HDx_Interface (J1.1), ETH_Interface (U2.20)
TX_P: HDx_Interface (J1.2), ETH_Interface (U2.21)
TXD0: ETH_Interface (R8.1), UC_Interface (U1.51)
TXD1: ETH_Interface (R7.1), UC_Interface (U1.52)
TXEN: ETH_Interface (R9.1), UC_Interface (U1.48)
VBAT: HDx_Interface (J1.23), UC_Interface (U1.6)
VCC: HDx_Interface (7 pins), ETH_Interface (5 pins), UC_Interface (17 pins)
VREF: HDx_Interface (J3.5), UC_Interface (C7.1 U1.21)